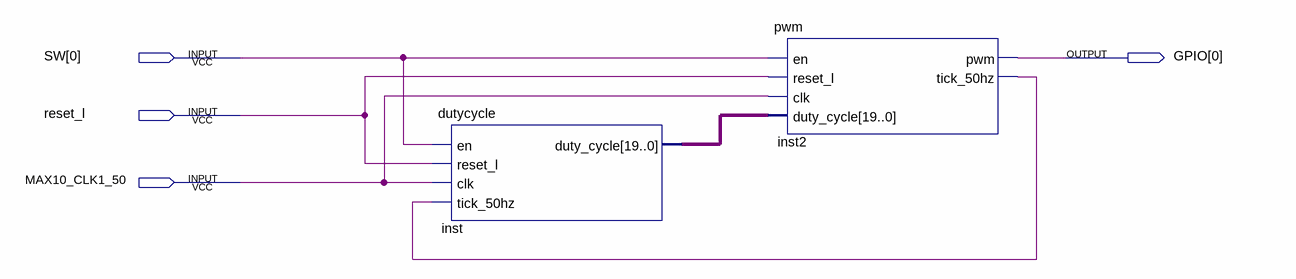
[diagram p0: schematic sheet]
// Quartus schematic motor.bdf as structural Verilog: 2 symbols, 4 pins
module motor (
  input  [0:0] SW,
  input  reset_l,
  input  MAX10_CLK1_50,
  output [0:0] GPIO
);

  wire inst2_tick_50hz;
  wire [19:0] inst_duty_cycle;

  dutycycle inst (
    .en(SW[0]), .reset_l(reset_l), .clk(MAX10_CLK1_50), .tick_50hz(inst2_tick_50hz),
    .duty_cycle(inst_duty_cycle));
  pwm inst2 (
    .en(SW[0]), .reset_l(reset_l), .clk(MAX10_CLK1_50), .duty_cycle(inst_duty_cycle), .pwm(GPIO[0]),
    .tick_50hz(inst2_tick_50hz));
endmodule
